# Altium project PCB2.PrjPcb
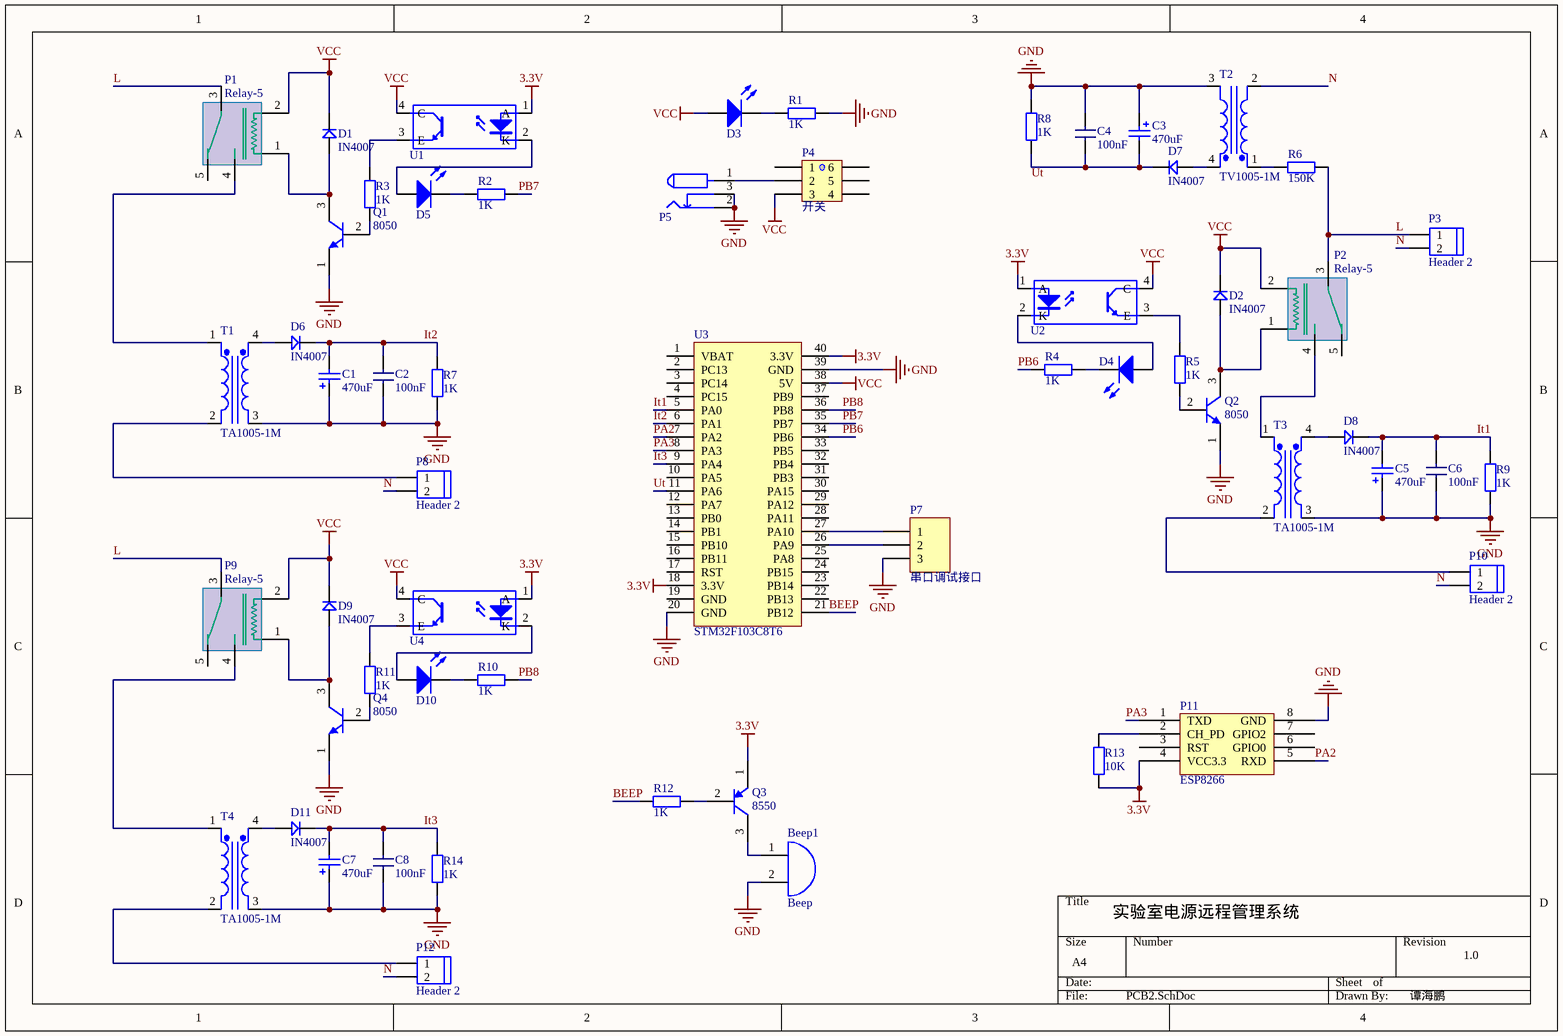
[diagram p0: PCB2.SchDoc]
1 sheet, 57 parts. Net scope: global (net labels, ports and power ports of the same name join across sheets).
Board files: PCB2.PcbDoc, PCB_Logo.PcbDoc

## Sheet PCB2.SchDoc: 实验室电源远程管理系统
size A4; DrawnBy: 谭海鹏; Revision: 1.0

### Parts
Beep1  Beep  [Bell]
C1  value 470uF  [Cap]  (hidden comment: CAP-A)
C2  value 100nF  [Cap]  (hidden comment: CAP-B)
C3  value 470uF  [Cap]  (hidden comment: CAP-A)
C4  value 100nF  [Cap]  (hidden comment: CAP-B)
C5  value 470uF  [Cap]  (hidden comment: CAP-A)
C6  value 100nF  [Cap]  (hidden comment: CAP-B)
C7  value 470uF  [Cap]  (hidden comment: CAP-A)
C8  value 100nF  [Cap]  (hidden comment: CAP-B)
D1  value IN4007  [Diode]  (hidden comment: Diode)
D2  value IN4007  [Diode]  (hidden comment: Diode)
D3  LED  [LED]  (value not drawn)
D4  LED  [LED]  (value not drawn)
D5  LED  [LED]  (value not drawn)
D6  value IN4007  [Diode]  (hidden comment: Diode)
D7  value IN4007  [Diode]  (hidden comment: Diode)
D8  value IN4007  [Diode]  (hidden comment: Diode)
D9  value IN4007  [Diode]  (hidden comment: Diode)
D10  LED  [LED]  (value not drawn)
D11  value IN4007  [Diode]  (hidden comment: Diode)
P1  Relay-5  [Relay]
P2  Relay-5  [Relay]
P3  Header 2  [HDR1X2]
P4  开关  [Switch]
P5  电源插座  [DC]  (value not drawn)
P7  串口调试接口  [HDR1X3]
P8  Header 2  [HDR1X2]
P9  Relay-5  [Relay]
P10  Header 2  [HDR1X2]
P11  ESP8266  [ESP8266]
P12  Header 2  [HDR1X2]
Q1  value 8050  [Triode]  (hidden comment: NPN)
Q2  value 8050  [Triode]  (hidden comment: NPN)
Q3  value 8550  [Triode]  (hidden comment: PNP)
Q4  value 8050  [Triode]  (hidden comment: NPN)
R1  value 1K  [RES]  (hidden comment: RES)
R2  value 1K  [RES]  (hidden comment: RES)
R3  value 1K  [RES]  (hidden comment: RES)
R4  value 1K  [RES]  (hidden comment: RES)
R5  value 1K  [RES]  (hidden comment: RES)
R6  value 150K  [RES]  (hidden comment: RES)
R7  value 1K  [RES]  (hidden comment: RES)
R8  value 1K  [RES]  (hidden comment: RES)
R9  value 1K  [RES]  (hidden comment: RES)
R10  value 1K  [RES]  (hidden comment: RES)
R11  value 1K  [RES]  (hidden comment: RES)
R12  value 1K  [RES]  (hidden comment: RES)
R13  value 10K  [RES]  (hidden comment: RES)
R14  value 1K  [RES]  (hidden comment: RES)
T1  TA1005-1M  [Transforme]
T2  TV1005-1M  [Transforme]
T3  TA1005-1M  [Transforme]
T4  TA1005-1M  [Transforme]
U1  Optoisolator  [DIP-4]  (value not drawn)
U2  Optoisolator  [DIP-4]  (value not drawn)
U3  STM32F103C8T6  [STM32F103C8T6]
U4  Optoisolator  [DIP-4]  (value not drawn)

### Nets
3.3V: P11.4(VCC3.3) Q3.1(E) R13.1 U1.1(A) U2.1(A) U3.18(3.3V) U3.40(3.3V) U4.1(A)
GND: Beep1.2(B) C1.1 C2.1 C3.1 C4.1 C5.1 C6.1 C7.1 C8.1 P5.2 P5.3 P7.3 P11.8(GND) Q1.1 Q2.1 Q4.1 R1.1 R7.1 R8.1 R9.1 R14.1 T1.3(Sec-) T2.3(Sec-) T3.3(Sec-) T4.3(Sec-) U3.20(GND) U3.39(GND)
VCC: D1.2 D2.2 D3.1(A) D9.2 P1.2 P2.2 P4.3 P9.2 U1.4(C) U2.4(C) U3.38(5V) U4.4(C)
BEEP: R12.1 U3.21(PB12)
It1: C5.2 C6.2 D8.2 R9.2 U3.5(PA0)
It2: C1.2 C2.2 D6.2 R7.2 U3.6(PA1)
It3: C7.2 C8.2 D11.2 R14.2 U3.9(PA4)
L: P1.3 P2.3 P3.1 P9.3 R6.1
N: P3.2 P8.2 P10.2 P12.2 T2.2(Pri-)
PA2: P11.5(RXD) U3.7(PA2)
PA3: P11.1(TXD) U3.8(PA3)
PB6: R4.2 U3.34(PB6)
PB7: R2.1 U3.35(PB7)
PB8: R10.2 U3.36(PB8)
Ut: U3.11(PA6)
NetBeep1_1: Beep1.1(A) Q3.3(C)
NetC3_2: C3.2 C4.2 D7.2 R8.2
NetD1_1: D1.1 P1.1 Q1.3(C)
NetD2_1: D2.1 P2.1 Q2.3(C)
NetD3_2: D3.2(K) R1.2
NetD4_1: D4.1(A) U2.2(K)
NetD4_2: D4.2(K) R4.1
NetD5_1: D5.1(A) U1.2(K)
NetD5_2: D5.2(K) R2.2
NetD6_1: D6.1 T1.4(Sec+)
NetD7_1: D7.1 T2.4(Sec+)
NetD8_1: D8.1 T3.4(Sec+)
NetD9_1: D9.1 P9.1 Q4.3(C)
NetD10_1: D10.1(A) U4.2(K)
NetD10_2: D10.2(K) R10.1
NetD11_1: D11.1 T4.4(Sec+)
NetP1_4: P1.4 T1.1(Pri+)
NetP2_4: P2.4 T3.1(Pri+)
NetP4_2: P4.2 P5.1
NetP7_1: P7.1 U3.27(PA10)
NetP7_2: P7.2 U3.26(PA9)
NetP8_1: P8.1 T1.2(Pri-)
NetP9_4: P9.4 T4.1(Pri+)
NetP10_1: P10.1 T3.2(Pri-)
NetP11_2: P11.2(CH_PD) R13.2
NetP12_1: P12.1 T4.2(Pri-)
NetQ1_2: Q1.2(B) R3.1
NetQ2_2: Q2.2(B) R5.2
NetQ3_2: Q3.2(B) R12.2
NetQ4_2: Q4.2(B) R11.1
NetR3_2: R3.2 U1.3(E)
NetR5_1: R5.1 U2.3(E)
NetR6_2: R6.2 T2.1(Pri+)
NetR11_2: R11.2 U4.3(E)

Not connected (* = marked no-connect by the designer): P1 5; P2 5; P4 1 4 5 6; P9 5; P11 3(RST) 6(GPIO0) 7(GPIO2); U3 1(VBAT) 2(PC13) 3(PC14) 4(PC15) 10(PA5) 12(PA7) 13(PB0) 14(PB1) 15(PB10) 16(PB11) 17(RST) 19(GND) 22(PB13) 23(PB14) 24(PB15) 25(PA8) 28(PA11) 29(PA12) 30(PA15) 31(PB3) 32(PB4) 33(PB5) 37(PB9)

### Notes on the sheet
- Labels drawn without touching a wire or pin: Ut

### Library data of the parts
Beep1 = Bell: 蜂鸣器
C1 C3 C5 C7 = CAP-A: 电解电容
C2 C4 C6 C8 = CAP-B: 瓷片电容
D1 D2 D6-D9 D11 = Diode: 整流二极管
P1 P2 P9 = Relay-5: 5针继电器
P3 P8 P10 P12 = Header 2: 两孔端子
P4 = Switch
P5 = POWER: DC电源插口
P7 = Header 3: Header, 3-Pin; LatestRevisionDate: 17-Jul-2002; LatestRevisionNote: Re-released for DXP Platform.; Publisher: Altium Limited
P11 = ESP8266: WIFI模块（8针）
R1-R14 = RES: 电阻
T1 T3 T4 = Transforme-A: 电流互感器
T2 = Transforme-V: 电压互感器
U1 U2 U4 = Optoisolator: 光耦隔离器
U3 = STM32F103C8T6: STM32最小系统（40针）